# Altium schematic sheet Selector.SchDoc
size A4
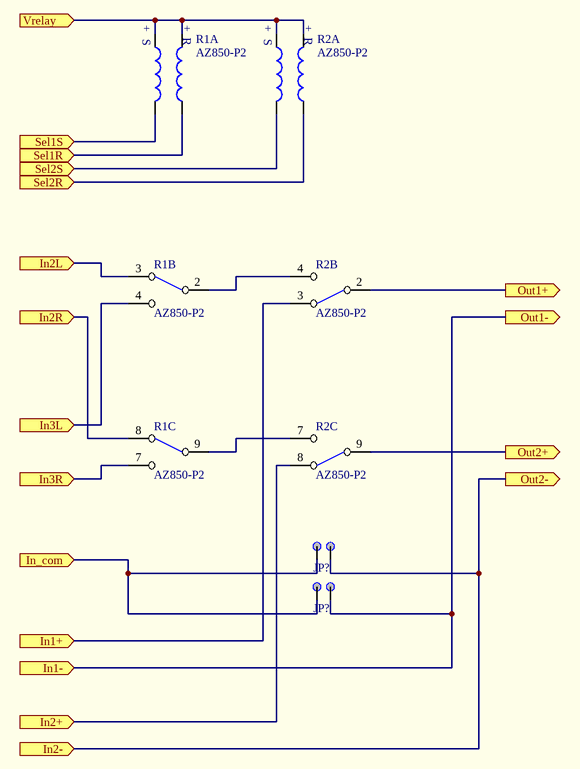
[diagram p0: Selector.SchDoc]

## Parts
(Parts that share a designator on the sheet are numbered #1, #2 ... from top to bottom, then left to right.)
JP?#1  Jumper, 2pin  [JP2]  (value not drawn)
JP?#2  Jumper, 2pin  [JP2]  (value not drawn)
R1  AZ850-P2  [RELAY_AZ850]  (parts A,B,C of 3)
R2  AZ850-P2  [RELAY_AZ850]  (parts A,B,C of 3)

## Ports
In1+ (in), In1- (in), In2+ (in), In2- (in), In2L (in), In2R (in), In3L (in), In3R (in), In_com (in), Out1+ (out), Out1- (out), Out2+ (out), Out2- (out), Sel1R (in), Sel1S (in), Sel2R (in), Sel2S (in), Vrelay (in)

## Nets
In1+: R2.3 ; port In1+
In1-: JP?#2.2 ; port In1-, port Out1-
In2+: R2.8 ; port In2+
In2-: JP?#1.2 ; port In2-, port Out2-
In2L: R1.3 ; port In2L
In2R: R1.8 ; port In2R
In3L: R1.4 ; port In3L
In3R: R1.7 ; port In3R
In_com: JP?#1.1 JP?#2.1 ; port In_com
Out1+: R2.2 ; port Out1+
Out2+: R2.9 ; port Out2+
Sel1R: R1.6 ; port Sel1R
Sel1S: R1.5 ; port Sel1S
Sel2R: R2.6 ; port Sel2R
Sel2S: R2.5 ; port Sel2S
Vrelay: R1.1 R1.10 R2.1 R2.10 ; port Vrelay
NetR1_2: R1.2 R2.4
NetR1_9: R1.9 R2.7

## Notes on the sheet
- (in symbol AZ850, part A) +; S; R

## Library data of the parts
JP?#1 JP?#2 = JP2
R1 R2 = AZ850: bi-stable relay